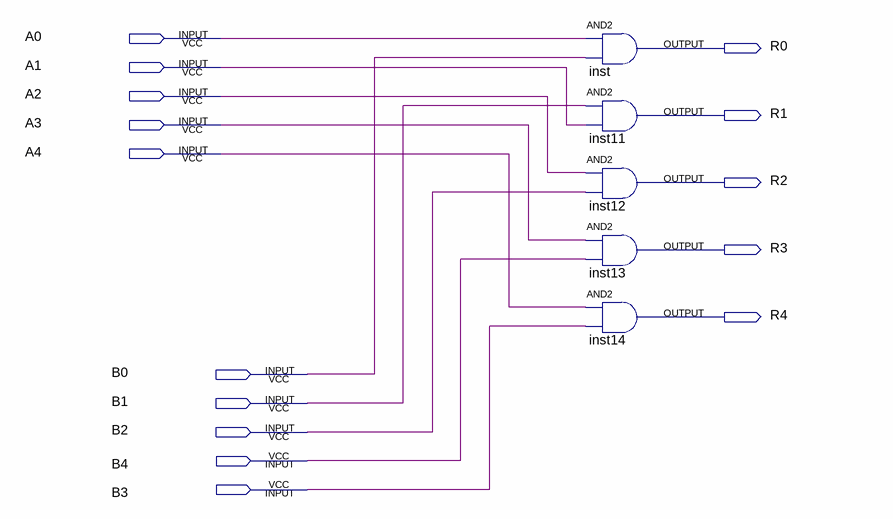
[diagram p0: schematic sheet]
// Quartus schematic sdProject_And.bdf as structural Verilog: 5 symbols, 15 pins
module sdProject_And (
  input  A0,
  input  A1,
  input  A2,
  input  A3,
  input  A4,
  input  B0,
  input  B1,
  input  B2,
  input  B4,
  input  B3,
  output R0,
  output R1,
  output R2,
  output R3,
  output R4
);

  and inst (R0, A0, B0);
  and inst11 (R1, B1, A1);
  and inst12 (R2, A2, B2);
  and inst13 (R3, A3, B4);
  and inst14 (R4, A4, B3);
endmodule
